# EAGLE design 9Mux_v5 (EAGLE 7.6.0)
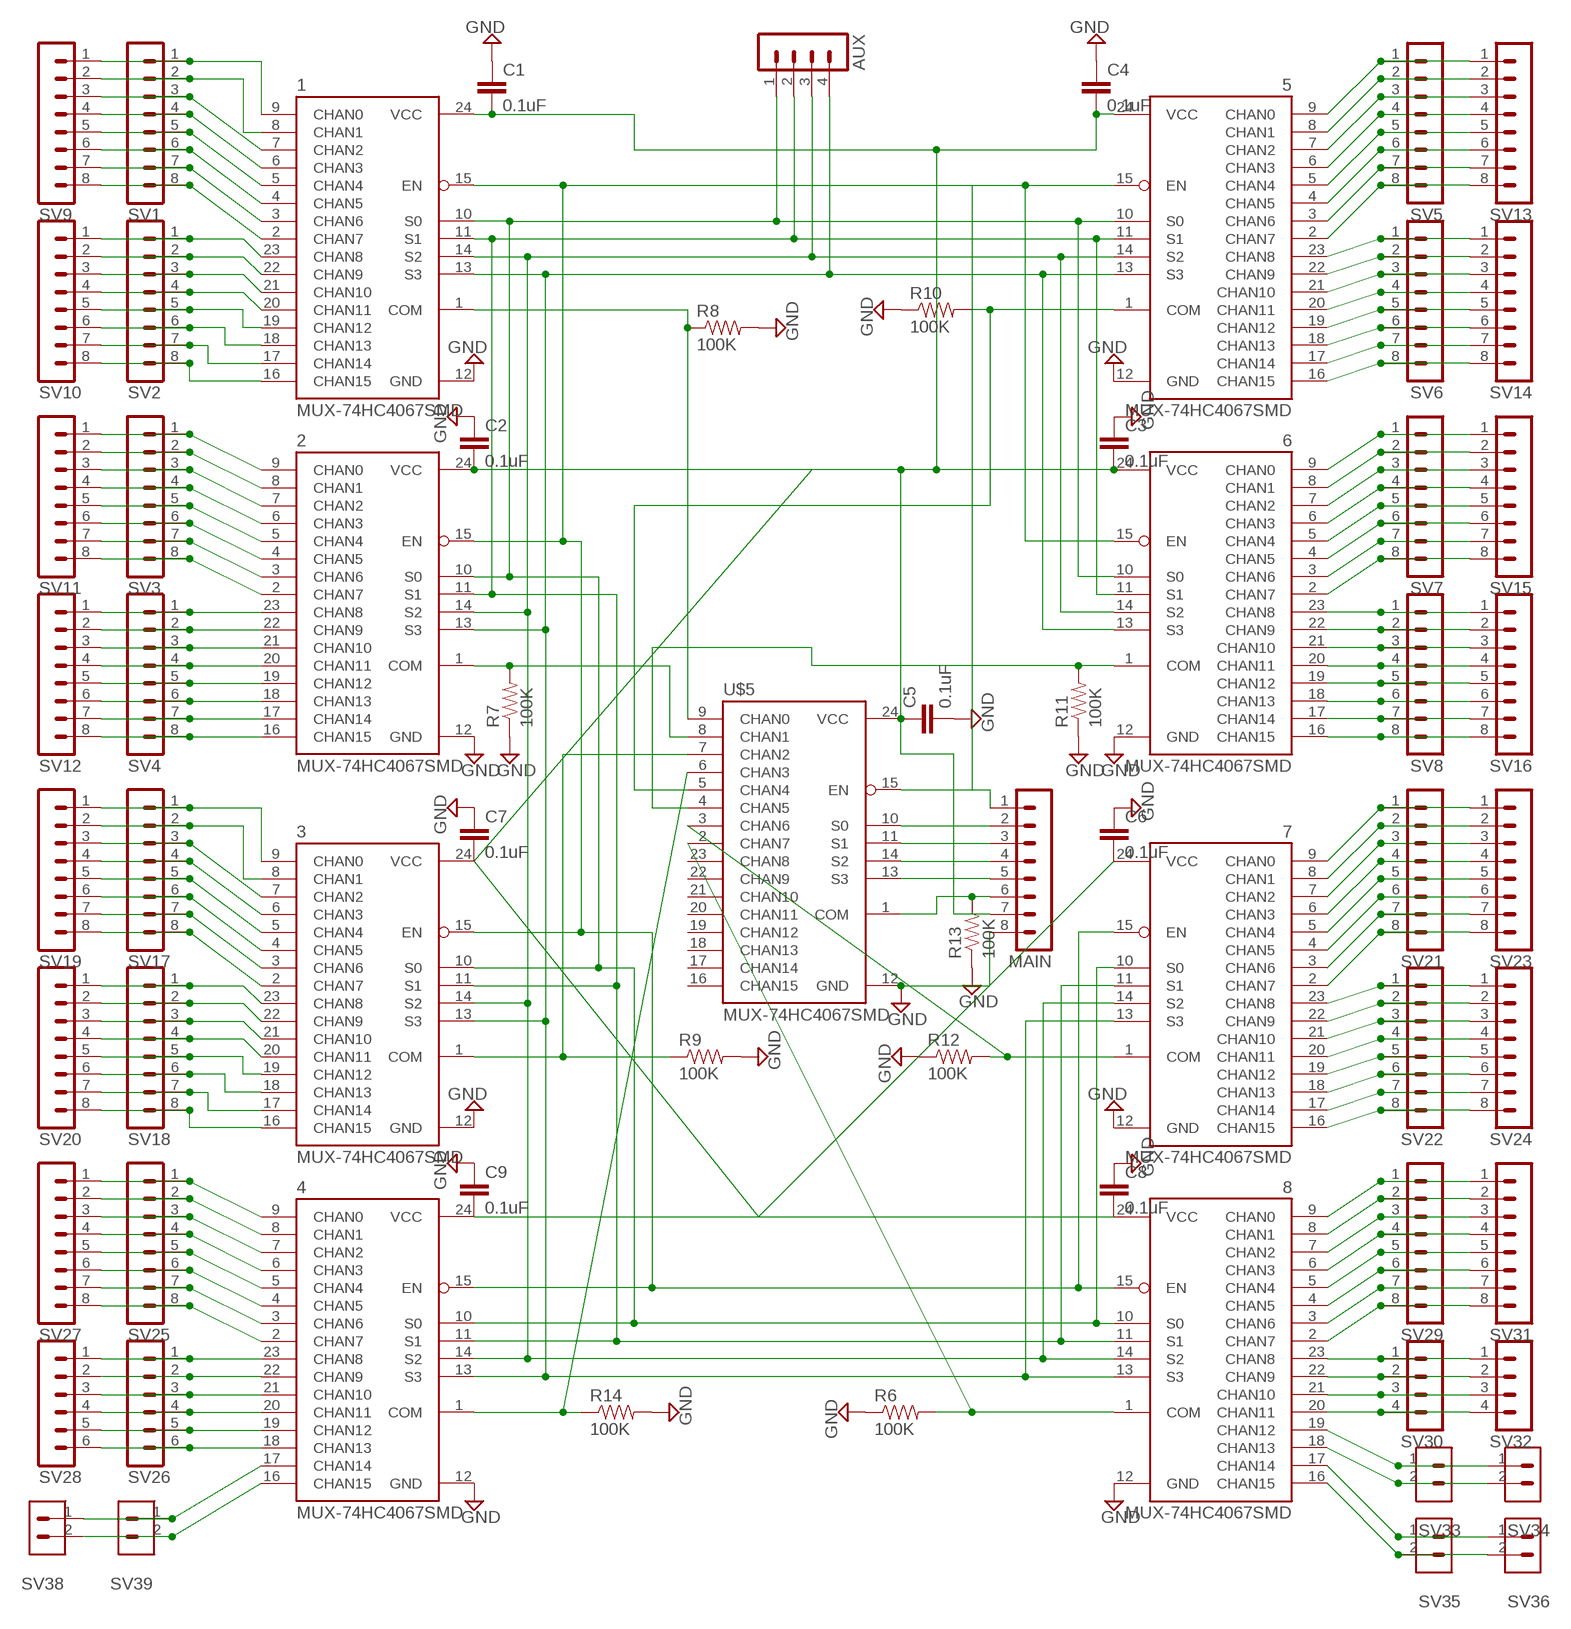
[diagram p0: schematic, sheet 1]

## Parts
1  MUX-74HC4067SMD  [SSOP24]
2  MUX-74HC4067SMD  [SSOP24]
3  MUX-74HC4067SMD  [SSOP24]
4  MUX-74HC4067SMD  [SSOP24]
5  MUX-74HC4067SMD  [SSOP24]
6  MUX-74HC4067SMD  [SSOP24]
7  MUX-74HC4067SMD  [SSOP24]
8  MUX-74HC4067SMD  [SSOP24]
AUX  MA04-1  [MA04-1]
C1  0.1uF  CAP0603-CAP  [0603-CAP]
C2  0.1uF  CAP0603-CAP  [0603-CAP]
C3  0.1uF  CAP0603-CAP  [0603-CAP]
C4  0.1uF  CAP0603-CAP  [0603-CAP]
C5  0.1uF  CAP0603-CAP  [0603-CAP]
C6  0.1uF  CAP0603-CAP  [0603-CAP]
C7  0.1uF  CAP0603-CAP  [0603-CAP]
C8  0.1uF  CAP0603-CAP  [0603-CAP]
C9  0.1uF  CAP0603-CAP  [0603-CAP]
MAIN  MA08-1  [MA08-1]
R6  100K  RESISTOR0603  [0603-RES]
R7  100K  RESISTOR0603  [0603-RES]
R8  100K  RESISTOR0603  [0603-RES]
R9  100K  RESISTOR0603  [0603-RES]
R10  100K  RESISTOR0603  [0603-RES]
R11  100K  RESISTOR0603  [0603-RES]
R12  100K  RESISTOR0603  [0603-RES]
R13  100K  RESISTOR0603  [0603-RES]
R14  100K  RESISTOR0603  [0603-RES]
SV1  MA08-1  [MA08-1]
SV2  MA08-1  [MA08-1]
SV3  MA08-1  [MA08-1]
SV4  MA08-1  [MA08-1]
SV5  MA08-1  [MA08-1]
SV6  MA08-1  [MA08-1]
SV7  MA08-1  [MA08-1]
SV8  MA08-1  [MA08-1]
SV9  MA08-1  [MA08-1]
SV10  MA08-1  [MA08-1]
SV11  MA08-1  [MA08-1]
SV12  MA08-1  [MA08-1]
SV13  MA08-1  [MA08-1]
SV14  MA08-1  [MA08-1]
SV15  MA08-1  [MA08-1]
SV16  MA08-1  [MA08-1]
SV17  MA08-1  [MA08-1]
SV18  MA08-1  [MA08-1]
SV19  MA08-1  [MA08-1]
SV20  MA08-1  [MA08-1]
SV21  MA08-1  [MA08-1]
SV22  MA08-1  [MA08-1]
SV23  MA08-1  [MA08-1]
SV24  MA08-1  [MA08-1]
SV25  MA08-1  [MA08-1]
SV26  MA06-1  [MA06-1]
SV27  MA08-1  [MA08-1]
SV28  MA06-1  [MA06-1]
SV29  MA08-1  [MA08-1]
SV30  MA04-1  [MA04-1]
SV31  MA08-1  [MA08-1]
SV32  MA04-1  [MA04-1]
SV33  MA02-1  [MA03-1]
SV34  MA02-1  [MA03-1]
SV35  MA02-1  [MA03-1]
SV36  MA02-1  [MA03-1]
SV38  MA02-1  [MA03-1]
SV39  MA02-1  [MA03-1]
U$5  MUX-74HC4067SMD  [SSOP24]

## Nets
GND: 1.12(GND) 2.12(GND) 3.12(GND) 4.12(GND) 5.12(GND) 6.12(GND) 7.12(GND) 8.12(GND) C1.1 C2.1 C3.1 C4.1 C5.2 C6.1 C7.1 C8.1 C9.1 MAIN.8 R6.1 R7.1 R8.2 R9.2 R10.1 R11.1 R12.1 R13.1 R14.2 U$5.12(GND)
MAIN: 1.11(S1) 2.11(S1) 3.11(S1) 4.11(S1) 5.11(S1) 6.11(S1) 7.11(S1) 8.11(S1) AUX.2
N$1: 1.9(CHAN0) SV1.1 SV9.1
N$2: 1.8(CHAN1) SV1.2 SV9.2
N$3: 1.16(CHAN15) SV2.8 SV10.8
N$4: 1.17(CHAN14) SV2.7 SV10.7
N$5: 1.18(CHAN13) SV2.6 SV10.6
N$6: 2.8(CHAN1) SV3.2 SV11.2
N$7: 1.19(CHAN12) SV2.5 SV10.5
N$8: 1.20(CHAN11) SV2.4 SV10.4
N$9: 1.21(CHAN10) SV2.3 SV10.3
N$10: 1.22(CHAN9) SV2.2 SV10.2
N$11: 1.23(CHAN8) SV2.1 SV10.1
N$12: 1.7(CHAN2) SV1.3 SV9.3
N$13: 1.6(CHAN3) SV1.4 SV9.4
N$14: 1.5(CHAN4) SV1.5 SV9.5
N$15: 1.4(CHAN5) SV1.6 SV9.6
N$16: 1.3(CHAN6) SV1.7 SV9.7
N$17: 1.2(CHAN7) SV1.8 SV9.8
N$18: 2.9(CHAN0) SV3.1 SV11.1
N$19: 2.7(CHAN2) SV3.3 SV11.3
N$20: 2.6(CHAN3) SV3.4 SV11.4
N$21: 2.5(CHAN4) SV3.5 SV11.5
N$22: 5.5(CHAN4) SV5.5 SV13.5
N$23: 2.4(CHAN5) SV3.6 SV11.6
N$24: 2.3(CHAN6) SV3.7 SV11.7
N$25: 2.2(CHAN7) SV3.8 SV11.8
N$26: 2.23(CHAN8) SV4.1 SV12.1
N$27: 2.22(CHAN9) SV4.2 SV12.2
N$28: 2.21(CHAN10) SV4.3 SV12.3
N$29: 2.20(CHAN11) SV4.4 SV12.4
N$30: 2.19(CHAN12) SV4.5 SV12.5
N$31: 2.18(CHAN13) SV4.6 SV12.6
N$32: 2.17(CHAN14) SV4.7 SV12.7
N$33: 2.16(CHAN15) SV4.8 SV12.8
N$34: 5.9(CHAN0) SV5.1 SV13.1
N$35: 5.8(CHAN1) SV5.2 SV13.2
N$36: 5.7(CHAN2) SV5.3 SV13.3
N$37: 5.6(CHAN3) SV5.4 SV13.4
N$38: 5.4(CHAN5) SV5.6 SV13.6
N$39: 5.3(CHAN6) SV5.7 SV13.7
N$40: 5.2(CHAN7) SV5.8 SV13.8
N$41: 5.23(CHAN8) SV6.1 SV14.1
N$42: 5.22(CHAN9) SV6.2 SV14.2
N$43: 5.21(CHAN10) SV6.3 SV14.3
N$44: 5.20(CHAN11) SV6.4 SV14.4
N$45: 5.19(CHAN12) SV6.5 SV14.5
N$46: 5.18(CHAN13) SV6.6 SV14.6
N$47: 5.17(CHAN14) SV6.7 SV14.7
N$48: 5.16(CHAN15) SV6.8 SV14.8
N$49: 6.9(CHAN0) SV7.1 SV15.1
N$50: 6.8(CHAN1) SV7.2 SV15.2
N$51: 6.7(CHAN2) SV7.3 SV15.3
N$52: 6.6(CHAN3) SV7.4 SV15.4
N$53: 6.5(CHAN4) SV7.5 SV15.5
N$54: 1.10(S0) 2.10(S0) 3.10(S0) 4.10(S0) 5.10(S0) 6.10(S0) 7.10(S0) 8.10(S0) AUX.1
N$55: 6.4(CHAN5) SV7.6 SV15.6
N$56: 1.14(S2) 2.14(S2) 3.14(S2) 4.14(S2) 5.14(S2) 6.14(S2) 7.14(S2) 8.14(S2) AUX.3
N$57: 6.3(CHAN6) SV7.7 SV15.7
N$58: 6.2(CHAN7) SV7.8 SV15.8
N$59: 6.23(CHAN8) SV8.1 SV16.1
N$60: 1.13(S3) 2.13(S3) 3.13(S3) 4.13(S3) 5.13(S3) 6.13(S3) 7.13(S3) 8.13(S3) AUX.4
N$61: 1.15(EN) 2.15(EN) 3.15(EN) 4.15(EN) 5.15(EN) 6.15(EN) 7.15(EN) 8.15(EN) MAIN.1 U$5.15(EN)
N$62: 6.22(CHAN9) SV8.2 SV16.2
N$63: 6.21(CHAN10) SV8.3 SV16.3
N$64: 6.20(CHAN11) SV8.4 SV16.4
N$65: 6.19(CHAN12) SV8.5 SV16.5
N$66: 6.18(CHAN13) SV8.6 SV16.6
N$67: 6.17(CHAN14) SV8.7 SV16.7
N$68: 6.16(CHAN15) SV8.8 SV16.8
N$69: 1.1(COM) R8.1 U$5.9(CHAN0)
N$70: 3.9(CHAN0) SV17.1 SV19.1
N$71: 3.8(CHAN1) SV17.2 SV19.2
N$72: 3.16(CHAN15) SV18.8 SV20.8
N$73: 2.1(COM) R7.2 U$5.8(CHAN1)
N$74: 6.1(COM) R11.2 U$5.4(CHAN5)
N$75: 5.1(COM) R10.2 U$5.5(CHAN4)
N$78: MAIN.2 U$5.10(S0)
N$79: MAIN.3 U$5.11(S1)
N$80: MAIN.4 U$5.14(S2)
N$81: MAIN.5 U$5.13(S3)
N$82: MAIN.6 R13.2 U$5.1(COM)
N$83: 3.17(CHAN14) SV18.7 SV20.7
N$84: 3.18(CHAN13) SV18.6 SV20.6
N$85: 3.19(CHAN12) SV18.5 SV20.5
N$86: 3.20(CHAN11) SV18.4 SV20.4
N$87: 3.21(CHAN10) SV18.3 SV20.3
N$88: 3.22(CHAN9) SV18.2 SV20.2
N$89: 3.23(CHAN8) SV18.1 SV20.1
N$90: 3.7(CHAN2) SV17.3 SV19.3
N$91: 3.6(CHAN3) SV17.4 SV19.4
N$92: 3.5(CHAN4) SV17.5 SV19.5
N$93: 3.4(CHAN5) SV17.6 SV19.6
N$94: 3.3(CHAN6) SV17.7 SV19.7
N$95: 3.2(CHAN7) SV17.8 SV19.8
N$96: 7.9(CHAN0) SV21.1 SV23.1
N$97: 7.8(CHAN1) SV21.2 SV23.2
N$98: 7.7(CHAN2) SV21.3 SV23.3
N$99: 7.6(CHAN3) SV21.4 SV23.4
N$100: 7.5(CHAN4) SV21.5 SV23.5
N$101: 7.4(CHAN5) SV21.6 SV23.6
N$102: 7.3(CHAN6) SV21.7 SV23.7
N$103: 7.2(CHAN7) SV21.8 SV23.8
N$104: 7.23(CHAN8) SV22.1 SV24.1
N$105: 7.22(CHAN9) SV22.2 SV24.2
N$106: 7.21(CHAN10) SV22.3 SV24.3
N$107: 7.20(CHAN11) SV22.4 SV24.4
N$108: 7.19(CHAN12) SV22.5 SV24.5
N$109: 7.18(CHAN13) SV22.6 SV24.6
N$110: 7.17(CHAN14) SV22.7 SV24.7
N$111: 7.16(CHAN15) SV22.8 SV24.8
N$112: 4.9(CHAN0) SV25.1 SV27.1
N$113: 4.8(CHAN1) SV25.2 SV27.2
N$114: 4.7(CHAN2) SV25.3 SV27.3
N$115: 4.6(CHAN3) SV25.4 SV27.4
N$116: 4.5(CHAN4) SV25.5 SV27.5
N$117: 4.4(CHAN5) SV25.6 SV27.6
N$118: 4.3(CHAN6) SV25.7 SV27.7
N$119: 4.2(CHAN7) SV25.8 SV27.8
N$120: 4.23(CHAN8) SV26.1 SV28.1
N$121: 4.22(CHAN9) SV26.2 SV28.2
N$122: 4.21(CHAN10) SV26.3 SV28.3
N$123: 4.20(CHAN11) SV26.4 SV28.4
N$124: 4.19(CHAN12) SV26.5 SV28.5
N$125: 4.18(CHAN13) SV26.6 SV28.6
N$126: 4.17(CHAN14) SV38.1 SV39.1
N$127: 4.16(CHAN15) SV38.2 SV39.2
N$128: 8.9(CHAN0) SV29.1 SV31.1
N$129: 8.8(CHAN1) SV29.2 SV31.2
N$130: 8.7(CHAN2) SV29.3 SV31.3
N$131: 8.6(CHAN3) SV29.4 SV31.4
N$132: 8.5(CHAN4) SV29.5 SV31.5
N$133: 8.4(CHAN5) SV29.6 SV31.6
N$134: 8.3(CHAN6) SV29.7 SV31.7
N$135: 8.2(CHAN7) SV29.8 SV31.8
N$136: 8.23(CHAN8) SV30.1 SV32.1
N$137: 8.22(CHAN9) SV30.2 SV32.2
N$138: 8.21(CHAN10) SV30.3 SV32.3
N$139: 8.20(CHAN11) SV30.4 SV32.4
N$140: 3.1(COM) R9.1 U$5.7(CHAN2)
N$141: 7.1(COM) R12.2 U$5.3(CHAN6)
N$142: 4.1(COM) R14.1 U$5.6(CHAN3)
N$143: 8.1(COM) R6.2 U$5.2(CHAN7)
N$145: 1.24(VCC) 2.24(VCC) 3.24(VCC) 4.24(VCC) 5.24(VCC) 6.24(VCC) 7.24(VCC) 8.24(VCC) C1.2 C2.2 C3.2 C4.2 C5.1 C6.2 C7.2 C8.2 C9.2 MAIN.7 U$5.24(VCC)
N$148: 8.19(CHAN12) SV33.1 SV34.1
N$149: 8.18(CHAN13) SV33.2 SV34.2
N$150: 8.17(CHAN14) SV35.1 SV36.1
N$151: 8.16(CHAN15) SV35.2 SV36.2
Unconnected: U$5.16(CHAN15) U$5.17(CHAN14) U$5.18(CHAN13) U$5.19(CHAN12) U$5.20(CHAN11) U$5.21(CHAN10) U$5.22(CHAN9) U$5.23(CHAN8)

## Library data of the parts
1-8 U$5 = SparkFun-AnalogIC:MUX-74HC4067: 16-channel analog MUX; PROD_ID: IC-08252
AUX SV30 SV32 = con-lstb:MA04-1: PIN HEADER; OC_FARNELL: unknown; OC_NEWARK: unknown
C1-C9 = SparkFun-Passives:CAP: Capacitor Standard 0603 ceramic capacitor, and 0.1" leaded capacitor.
MAIN SV1-SV25 SV27 SV29 SV31 = con-lstb:MA08-1: PIN HEADER; OC_FARNELL: unknown; OC_NEWARK: unknown
R6-R14 = SparkFun-Resistors:RESISTOR: Resistor Basic schematic elements and footprints for 0603, 1206, and PTH resistors.
SV26 SV28 = con-lstb:MA06-1: PIN HEADER; OC_FARNELL: unknown; OC_NEWARK: unknown
SV33-SV36 SV38 SV39 = custom:MA02-1: PIN HEADER; OC_FARNELL: unknown; OC_NEWARK: unknown

## Net classes
0 signal: width 0.254 mm, clearance 0.254 mm

## Board
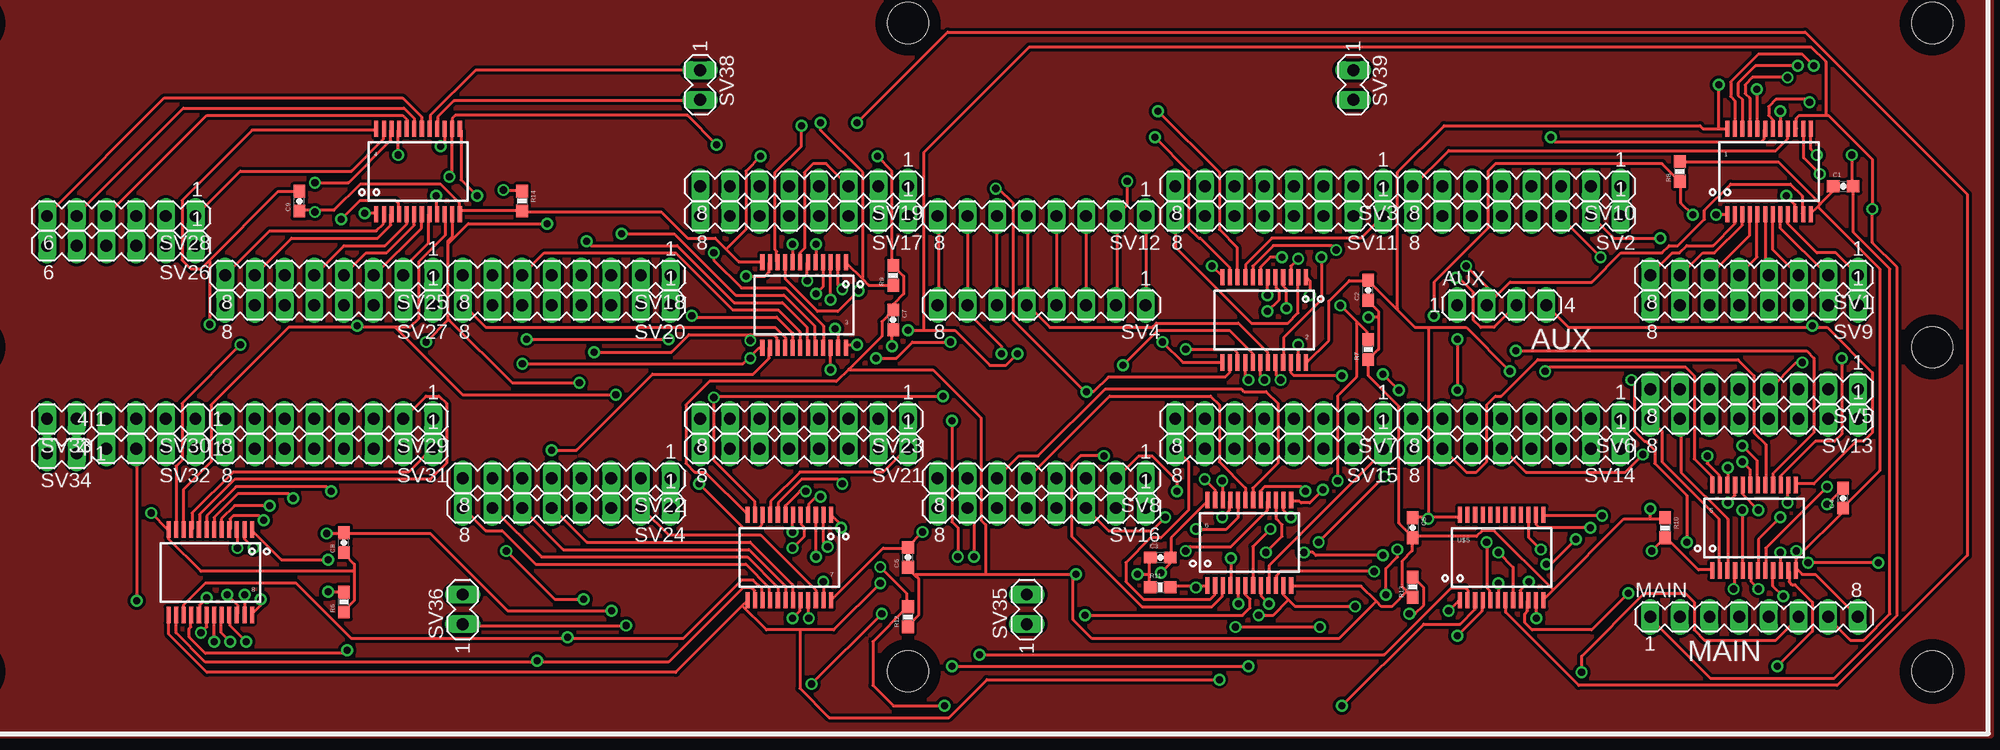
[diagram p1: board, top side]
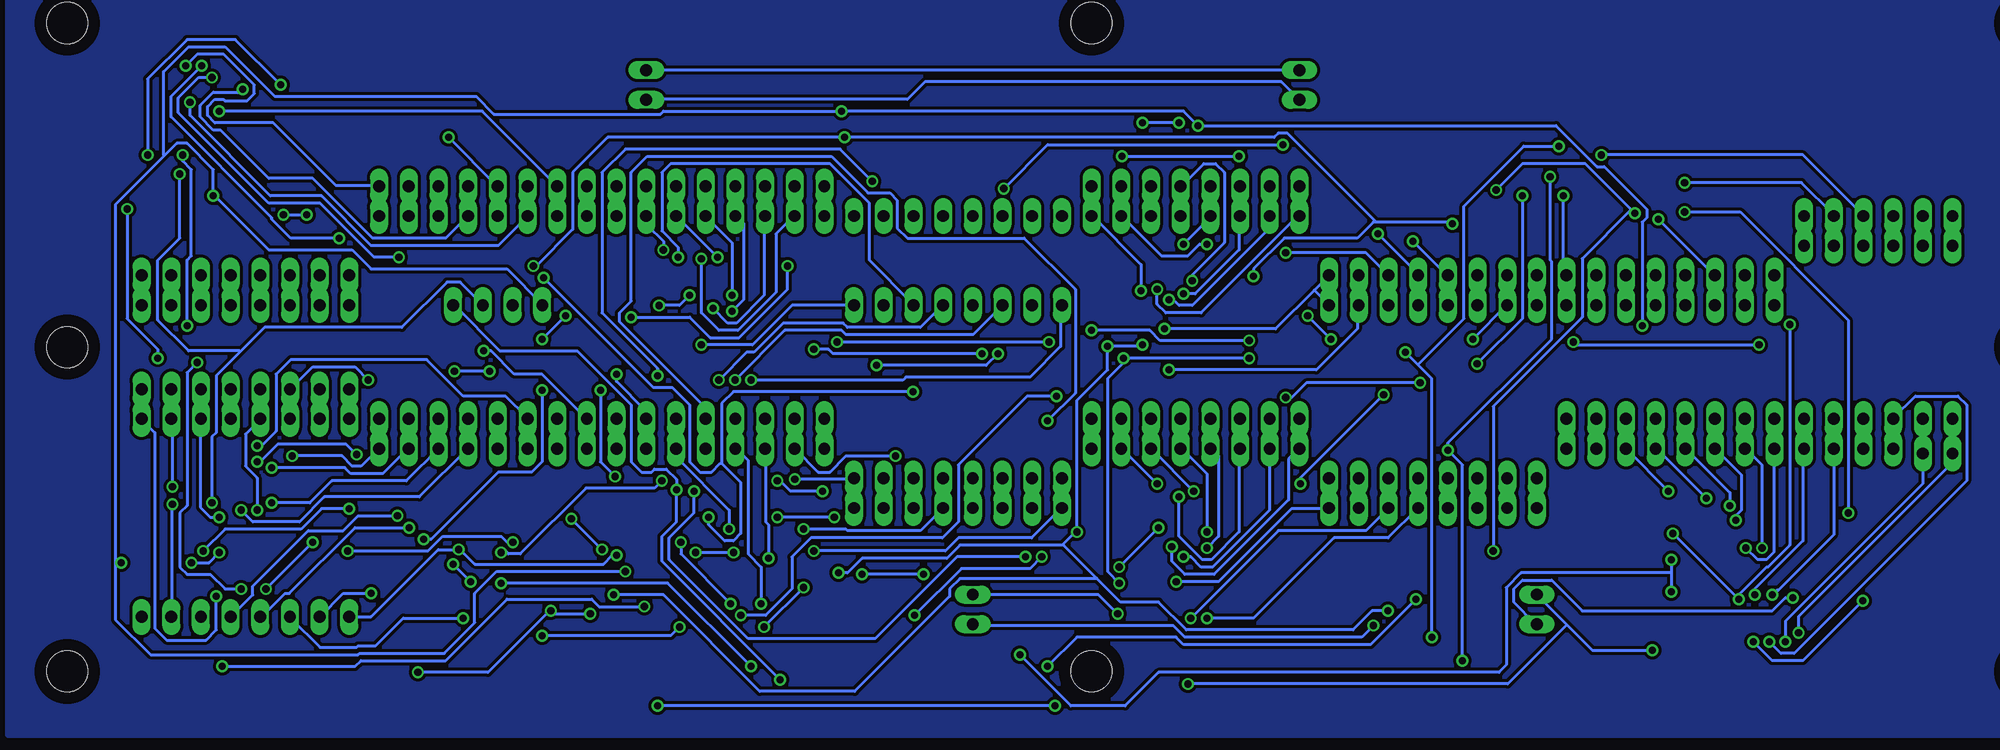
[diagram p2: board, bottom side, seen from below]

No outline drawn. Coordinates in mm, seen from the top.
Copper layers (1*16): Top 0.035mm / dielectric 1.5mm / Bottom 0.035mm
Design rules "default": minimum track width 10mil, minimum drill 24mil, track to track 8mil, track to pad 8mil, pad to pad 8mil, via to via 8mil, smd to smd 8mil, copper to edge 40mil, drill to drill 8mil, minimum pad ring 10mil, minimum via ring 8mil, stop-mask expansion 4mil, vias tented up to drill 0mil, thermal gap 10mil
Holes 3.5 mm at -1.27,70.06 78.74,97.79 166.37,70.06 166.37,42.33 166.37,97.79 -1.27,97.79 -1.27,42.33 78.74,42.33

### Footprints (pad centres in the part's own frame; a part is rotated, then mirrored left to right if it is on the bottom)
SSOP24 = smd 0.348 x 1.397: 1 -3.575,-3.656; 2 -2.925,-3.656; 3 -2.275,-3.656; 4 -1.625,-3.656; 5 -0.975,-3.656; 6 -0.325,-3.656; 7 0.325,-3.656; 8 0.975,-3.656; 9 1.625,-3.656; 10 2.275,-3.656; 11 2.925,-3.656; 12 3.575,-3.656; 13 3.575,3.656; 14 2.925,3.656; 15 2.275,3.656; 16 1.625,3.656; 17 0.975,3.656; 18 0.325,3.656; 19 -0.325,3.656; 20 -0.975,3.656; 21 -1.625,3.656; 22 -2.275,3.656; 23 -2.925,3.656; 24 -3.575,3.656
MA04-1 = drill 1.016 long: 1 -3.81,0; 2 -1.27,0; 3 1.27,0; 4 3.81,0
0603-CAP = smd 1.1 x 1: 1 -0.85,0; 2 0.85,0
MA08-1 = drill 1.016 long: 1 -8.89,0; 2 -6.35,0; 3 -3.81,0; 4 -1.27,0; 5 1.27,0; 6 3.81,0; 7 6.35,0; 8 8.89,0
0603-RES = smd 1.1 x 1: 1 -0.85,0; 2 0.85,0
MA06-1 = drill 1.016 long: 1 -6.35,0; 2 -3.81,0; 3 -1.27,0; 4 1.27,0; 5 3.81,0; 6 6.35,0
MA03-1 = drill 1.016 long: 1 -2.54,0; 2 0,0

### Placement (x,y rotation side)
1  152.4,85.09 0 top
2  109.22,72.39 180 top
3  69.85,73.66 180 top
4  36.83,85.09 0 top
5  151.13,54.61 0 top
6  107.95,53.34 0 top
7  68.58,52.07 180 top
8  19.05,50.8 180 top
AUX  129.54,73.66 0 top
C1  158.75,83.82 0 top
C2  118.11,74.93 90 top
C3  100.33,52.07 0 top
C4  158.75,57.15 90 top
C5  121.92,54.61 270 top
C6  78.74,52.07 90 top
C7  77.47,72.39 270 top
C8  30.48,53.34 90 top
C9  26.67,82.55 90 top
MAIN  151.13,46.99 0 top
R6  30.48,48.26 90 top
R7  118.11,69.85 90 top
R8  144.78,85.09 90 top
R9  77.47,76.2 90 top
R10  143.51,54.61 270 top
R11  100.33,49.53 0 top
R12  78.74,46.99 90 top
R13  121.92,49.53 90 top
R14  45.72,82.55 270 top
SV1  151.13,76.2 180 top
SV2  130.81,81.28 180 top
SV3  110.49,83.82 180 top
SV4  90.17,73.66 180 top
SV5  151.13,66.46 180 top
SV6  130.81,63.92 180 top
SV7  110.49,63.92 180 top
SV8  90.17,58.84 180 top
SV9  151.13,73.66 180 top
SV10  130.81,83.82 180 top
SV11  110.49,81.28 180 top
SV12  90.17,81.28 180 top
SV13  151.13,63.92 180 top
SV14  130.81,61.38 180 top
SV15  110.49,61.38 180 top
SV16  90.17,56.3 180 top
SV17  69.85,81.28 180 top
SV18  49.53,76.2 180 top
SV19  69.85,83.82 180 top
SV20  49.53,73.66 180 top
SV21  69.85,61.38 180 top
SV22  49.53,58.84 180 top
SV23  69.85,63.92 180 top
SV24  49.53,56.3 180 top
SV25  29.21,76.2 180 top
SV26  11.43,78.74 180 top
SV27  29.21,73.66 180 top
SV28  11.43,81.28 180 top
SV29  29.21,63.92 180 top
SV30  13.97,63.92 180 top
SV31  29.21,61.38 180 top
SV32  13.97,61.38 180 top
SV33  5.08,63.92 180 top
SV34  5.08,60.96 180 top
SV35  88.9,48.9 90 top
SV36  40.64,48.9 90 top
SV38  60.96,91.22 270 top
SV39  116.84,91.22 270 top
U$5  129.54,52.07 0 top

### Tracks (layer width: path | path; a pad name or v marks a point on that pad's centre or on a via)
GND  (via drill 0.61)
  Top 0.254: 31.38,50.88 31.38,51.5 30.5,52.38 C8.1 | 31.38,50.88 31.38,48.38 30.5,47.5 R6.1 | 31.38,50.88 18.25,50.88 15.5,53.62 15.5,54.38 8.12 15.38,54.5 v14,55.88 | 28,81.75 29.62,81.75 31.88,84 38.75,84 40.38,82.38 40.38,81.5 4.12 40.5,81.75 45.62,81.75 R14.2 45.75,81.62 57.62,81.62 59.88,79.38 62.25,79.38 63.19,78.44 | 28,81.75 26.75,81.75 C9.1 | 63.19,78.44 64.25,77.38 66.25,77.38 3.12 | v28,81.62 28,81.75 | 99.38,50.62 99.38,52 C3.1 | 99.38,50.62 99.38,49.62 R11.1 | 79.31,50.56 78.75,51.12 C6.1 | 79.31,50.56 79.62,50.25 79.62,47.12 78.75,46.25 R12.1 | v98.38,50.62 99.38,50.62 | 85.38,50.62 79.38,50.62 79.31,50.56 | 85.38,50.62 v93.12,50.62 92.88,50.5 92.88,46.75 94.5,45.12 115.62,45.12 118.81,48.31 | 73.69,68.19 76.5,71 76.5,72.25 77.38,73.12 C7.1 77.5,73.25 77.5,73.75 78.38,74.62 78.38,76.12 77.5,77 R9.2 77.38,77.12 77.38,85.12 v76.12,86.38 | 73.69,68.19 72.62,67.12 61.75,67.12 59.75,65.12 59.75,60.12 60.5,59.38 61.38,59.38 65,55.75 7.12 | 85.38,50.62 85.38,54.88 85,55.25 85,64 80.88,68.12 73.75,68.12 73.69,68.19 | 155.06,52.31 154.75,52 154.75,51 5.12 154.88,51 155.25,50.62 156.38,50.62 160,47 MAIN.8 | 155.06,52.31 158.75,56 C4.1 158.75,56.38 161.88,59.5 161.88,76.75 156.56,82.06 | 156.56,82.06 156,81.5 1.12 | 156.56,82.06 156.81,82.31 | 156.81,82.31 157.88,83.38 157.88,83.75 C1.1 | 156.81,82.31 153.25,85.88 144.88,85.88 R8.2 | 119,72.62 119,73.12 118.12,74 C2.1 | 119,72.62 119,69.88 118.12,69 R7.1 118.12,68.88 118.12,67.62 120.75,65 120.75,55 121.88,53.88 C5.2 | v104.75,77 105.62,76.12 2.12 | 119,72.62 v118.12,72.62 | 121.44,49.19 121,49.62 121,51.75 121.88,52.62 121.88,53.75 C5.2
  Top 0.254: 121.44,49.19 121.88,48.75 R13.1 | 118.81,48.31 119.25,47.88 120.12,47.88 121.44,49.19 | 118.81,48.31 117.5,49.62 111.62,49.62 6.12 | 142.25,55.38 140,55.38 133.94,49.31 | 142.25,55.38 143.5,55.38 R10.1 | 133.94,49.31 133.12,48.5 U$5.12 | 133.94,49.31 128.88,54.38 127.88,54.38 127.38,53.88 122,53.88 C5.2 | v154.75,52.62 155.06,52.31 | 142.25,55.38 v142.25,56.25 | 63.19,78.44 64.88,80.12 64.88,85.12 v66.12,86.38
  Bottom 0.254: v14,55.88 14,72.38 23.25,81.62 v28,81.62 | v93.12,50.62 v98.38,50.62 | v104.75,77 104.75,75 108.88,70.88 111.38,70.88 113.12,72.62 v118.12,72.62 | v154.75,52.62 152.88,54.5 146.38,54.5 144.62,56.25 v142.25,56.25 | v76.12,86.38 v66.12,86.38
MAIN  (via drill 0.61)
  Top 0.254: 6.11 110.88,48.88 111.31,48.44 | 111.31,48.44 111.88,47.88 v117,47.88 | v153.12,42.75 156.12,45.75 156.12,48.25 154.62,49.75 154.38,49.75 154.12,50 154.12,50.88 5.11 | 1.11 155.25,81.5 155.25,83 154.25,84 149.12,84 146.88,81.75 146.88,81 144.62,78.75 143.88,78.75 143.25,78.12 139.75,78.12 137.25,75.62 130.25,75.62 128.38,73.75 AUX.2 129,74.5 v126.5,77 | 8.11 16.12,59.88 16.62,60.38 16.62,65.25 v21.62,70.25 | 39.38,72.38 v37.5,70.5 | 39.38,79 39.38,79.12 39.75,79.5 39.75,81.38 4.11 | 39.38,79 39.38,72.38 | v50.62,67 44.88,67 39.5,72.38 39.38,72.38 | 7.11 65.62,55.75 65.62,56.88 62.12,60.38 v62.12,65.75 62.12,65.88 v81.75,65.88 | v64.88,76.12 66.5,76.12 66.88,76.5 66.88,77.25 3.11 | v47.88,80.62 41.12,80.62 39.5,79 39.38,79 | v99.88,88 102.75,85.12 102.75,80.25 103.62,79.38 103.75,79.38 106.25,76.88 106.25,76.12 2.11 | 111.31,48.44 110,47.12 v108.75,47.12
  Bottom 0.254: v117,47.88 120.88,47.88 121.5,48.5 128.75,48.5 134,43.25 141.25,43.25 141.75,42.75 v153.12,42.75 | v21.62,70.25 37.25,70.25 v37.5,70.5 | v62.12,65.75 61.62,65.75 60.38,67 v50.62,67 | v64.88,76.12 64.88,76.75 62.25,79.38 56,79.38 54.62,80.75 54.5,80.75 | 54.5,80.75 48,80.75 v47.88,80.62 | 54.5,80.75 54.5,80.88 62,88.38 62.75,88.38 63.12,88 v99.88,88 120.12,88 123.12,85 123.12,80.12 126.25,77 v126.5,77 | v108.75,47.12 106.62,47.12 104.38,49.38 104.38,52.12 102.75,53.75 91.5,53.75 90.12,55.12 90.12,60 84.25,65.88 v81.75,65.88
N$1
  Top 0.254: 1.9 154,81.38 154,80.62 156.5,78.12 158.12,78.12 160,76.25 SV1.1 160.12,76.12 160.12,73.75 SV9.1
N$2
  Top 0.254: 1.8 153.38,80.25 157.38,76.25 SV1.2 157.5,76.12 157.5,73.75 SV9.2
N$3
  Top 0.254: 1.16 154,88.62 154,87.88 153,86.88 125,86.88 122,83.88 SV10.8 122,83.75 122,81.38 SV2.8
N$4  (via drill 0.61)
  Top 0.254: v153.38,90.25 1.17 | SV2.7 124.5,81.38 124.5,83.75 SV10.7
  Bottom 0.254: v153.38,90.25 130.88,90.25 124.5,83.88 SV10.7
N$5  (via drill 0.61)
  Top 0.254: v155.88,91 155.62,91.25 153,91.25 152.38,90.62 152.38,89.88 152.75,89.5 152.75,88.75 1.18 | SV2.6 SV10.6
  Bottom 0.254: v155.88,91 155.88,89.88 149,83 144.62,83 140.38,78.75 129.5,78.75 127,81.25 SV2.6
N$6  (via drill 0.61)
  Top 0.254: v115.38,78.38 115,78.75 110,78.75 108.25,77 108.25,76.12 2.8 | SV3.2 116.88,83.75 116.88,81.38 SV11.2
  Bottom 0.254: v115.38,78.38 115.38,79.12 116.75,80.5 116.75,81.25 SV11.2
N$7  (via drill 0.61)
  Top 0.254: v133.75,88 134.12,87.62 151.75,87.62 152,87.88 152,88.62 1.19 | SV2.5 129.62,81.38 129.62,83.75 SV10.5
  Bottom 0.254: v133.75,88 129.62,83.88 SV10.5
N$8  (via drill 0.61)
  Top 0.254: v151.38,92.12 151.38,88.75 1.20 | SV10.4 132.12,83.75 132.12,81.38 SV2.4
  Bottom 0.254: v151.38,92.12 151.62,91.88 153.88,91.88 155,90.75 155,89.75 153.88,88.62 153.25,88.62 149.12,84.5 145.38,84.5 140.25,79.38 134,79.38 132.12,81.25 SV2.4
N$9  (via drill 0.61)
  Top 0.254: v154,93.12 151,93.12 150.38,92.5 150.38,91.75 150.75,91.38 150.75,88.75 1.21 | v138,77.75 134.5,81.25 SV2.3 134.62,81.38 134.62,83.75 SV10.3
  Bottom 0.254: v154,93.12 155.12,93.12 156.88,91.38 156.88,90.12 149.12,82.38 144.75,82.38 140.12,77.75 v138,77.75
N$10  (via drill 0.61)
  Top 0.254: 1.22 150.12,91.25 149.75,91.62 149.75,92.62 151.25,94.12 v154.88,94.12 | v143.12,79.38 139.12,79.38 137.25,81.25 SV2.2 137.25,81.38 137.25,83.75 SV10.2
  Bottom 0.254: v154.88,94.12 157.5,91.5 157.5,89.75 148.88,81.12 148.88,81 147.25,79.38 v143.12,79.38
N$11  (via drill 0.61)
  Top 0.254: v156.25,94.12 155.25,95.12 151.5,95.12 149.12,92.75 149.12,91.5 149.5,91.12 149.5,88.75 1.23 | SV2.1 139.75,81.38 139.75,83.75 SV10.1
  Bottom 0.254: v156.25,94.12 155.25,95.12 153,95.12 150.38,92.5 150.38,91.75 151,91.12 152.88,91.12 153,91.25 153.75,91.25 154.38,90.62 154.38,89.88 153.75,89.25 148.75,89.25 143.38,83.88 139.75,83.88 SV10.1
N$12
  Top 0.254: 1.7 152.75,81.38 152.75,78.38 154.88,76.25 SV1.3 155,76.12 155,73.75 SV9.3
N$13
  Top 0.254: 1.6 152.12,81.38 152.12,76.5 152.38,76.25 SV1.4 152.5,76.12 152.5,73.75 SV9.4
N$14
  Top 0.254: 1.5 151.38,81.38 151.38,77.75 149.88,76.25 SV1.5 149.88,76.12 149.88,73.75 SV9.5
N$15
  Top 0.254: 1.4 150.75,81.38 150.75,79.62 147.38,76.25 SV1.6 147.38,76.12 147.38,73.75 SV9.6
N$16
  Top 0.254: 1.3 150.12,80.5 147.75,78.12 146.75,78.12 144.88,76.25 SV1.7 144.88,76.12 144.88,73.75 SV9.7
N$17
  Top 0.254: 1.2 149.5,81.38 149.5,80.62 147.62,78.75 145.38,78.75 144.75,78.12 144.12,78.12 142.25,76.25 SV1.8 142.25,76.12 142.25,73.75 SV9.8
N$18
  Top 0.254: 2.9 107.62,76.12 107.62,77.12 109.88,79.38 117.5,79.38 119.38,81.25 SV11.1 119.38,81.38 119.38,83.75 SV3.1
N$19  (via drill 0.61)
  Top 0.254: v110.75,77.75 109.75,77.75 108.88,76.88 108.88,76.12 2.7 | SV3.3 114.38,83.75 114.38,81.38 SV11.3
  Bottom 0.254: v110.75,77.75 114.25,81.25 SV11.3
N$20  (via drill 0.61)
  Top 0.254: v109.5,74.5 109.5,76 2.6 | SV3.4 111.75,83.75 111.75,81.38 SV11.4
  Bottom 0.254: v109.5,74.5 109.5,79 111.75,81.25 SV11.4
N$21  (via drill 0.61)
  Top 0.254: v109.5,73.12 110.5,74.12 110.5,74.88 110.25,75.12 110.25,76 2.5 | SV3.5 109.25,83.75 109.25,81.38 SV11.5
  Bottom 0.254: v109.5,73.12 108.5,74.12 108.5,80.62 109.12,81.25 SV11.5
N$22  (via drill 0.61)
  Top 0.254: v150.12,56.12 150.12,51 5.5 | SV5.5 149.88,66.38 149.88,64 SV13.5
  Bottom 0.254: v150.12,56.12 150.12,58.88 151.12,59.88 151.12,62.62 149.88,63.88 SV13.5
N$23  (via drill 0.61)
  Top 0.254: v111.12,73.38 111.12,75 110.88,75.25 110.88,76 2.4 | SV3.6 106.75,83.75 106.75,81.38 SV11.6
  Bottom 0.254: v111.12,73.38 109.88,72.12 109.12,72.12 106.75,74.5 106.75,81.25 SV11.6
N$24  (via drill 0.61)
  Top 0.254: v112.12,77.62 111.5,77 111.5,76.12 2.3 | SV3.7 104.25,83.75 104.25,81.38 SV11.7
  Bottom 0.254: v112.12,77.62 112.12,73 110.62,71.5 109,71.5 105.75,74.75 105.75,79.75 104.25,81.25 SV11.7
N$25
  Top 0.254: 2.2 112.12,76 112.12,73 111.25,72.12 108.12,72.12 101.62,78.62 101.62,81.25 SV11.8 101.62,81.38 101.62,83.75 SV3.8
N$26  (via drill 0.61)
  Top 0.254: v112.12,70.25 112.12,68.75 2.23 | SV12.1 99.12,81.25 99.12,73.75 SV4.1
  Bottom 0.254: v112.12,70.25 107.75,70.25 104.38,73.62 99.12,73.62 SV4.1
N$27  (via drill 0.61)
  Top 0.254: v115.88,67.62 111.75,67.62 111.5,67.88 111.5,68.62 2.22 | v97.5,84.25 97.5,82.25 96.62,81.38 SV12.2 96.62,81.25 96.62,73.75 SV4.2
  Bottom 0.254: v115.88,67.62 115.88,68.25 120.62,73 120.62,85 118.62,87 100.25,87 v97.5,84.25
N$28  (via drill 0.61)
  Top 0.254: v114.12,77.75 114.12,74.12 110.88,70.88 110.88,68.75 2.21 | SV12.3 94,81.25 94,73.75 SV4.3
  Bottom 0.254: v114.12,77.75 114.12,78.62 115.5,80 115.5,85 114.75,85.75 101.12,85.75 97.75,82.38 97.75,77.5 94,73.75 SV4.3
N$29  (via drill 0.61)
  Top 0.254: v110.62,67.25 110.25,67.62 110.25,68.62 2.20 | SV12.4 91.5,81.25 91.5,73.75 SV4.4
  Bottom 0.254: v110.62,67.25 108.25,69.62 107.62,69.62 105.12,72.12 100,72.12 99.62,71.75 93.38,71.75 91.5,73.62 SV4.4
N$30
  Top 0.254: 2.19 109.5,68.75 109.5,69.62 107,72.12 100,72.12 99.62,71.75 90.88,71.75 89,73.62 SV4.5 89,73.75 89,81.25 SV12.5
N$31  (via drill 0.61)
  Top 0.254: v109.25,67.25 108.88,67.62 108.88,68.62 2.18 | SV12.6 86.38,81.25 86.38,73.75 SV4.6
  Bottom 0.254: v109.25,67.25 105,71.5 100.12,71.5 99.75,71.12 88.88,71.12 86.38,73.62 SV4.6
N$32  (via drill 0.61)
  Top 0.254: v97.12,68.5 100.12,71.5 106.25,71.5 108.25,69.5 108.25,68.75 2.17 | v86.75,69.5 86.75,70.12 83.88,73 83.88,73.62 SV4.7 83.88,73.75 83.88,81.25 SV12.7
  Bottom 0.254: v97.12,68.5 87.75,68.5 v86.75,69.5
N$33  (via drill 0.61)
  Top 0.254: v107.88,67.25 107.62,67.5 107.62,68.62 2.16 | SV12.8 81.38,81.25 81.38,73.75 SV4.8
  Bottom 0.254: v107.88,67.25 94.88,67.25 94.62,67.5 84,67.5 81.38,70.12 81.38,73.62 SV4.8
N$34  (via drill 0.61)
  Top 0.254: v153.62,48.75 152.75,49.62 152.75,50.88 5.9 | SV5.1 160.12,66.38 160.12,64 SV13.1
  Bottom 0.254: v153.62,48.75 153.62,45.88 154.5,45 157.88,45 158.88,46 158.88,62.75 160,63.88 SV13.1
N$35  (via drill 0.61)
  Top 0.254: v157.38,58.12 152.12,52.88 152.12,51 5.8 | SV5.2 157.5,66.38 157.5,64 SV13.2
  Bottom 0.254: v157.38,58.12 157.38,63.88 SV13.2
N$36  (via drill 0.61)
  Top 0.254: v153.38,55.5 151.5,53.62 151.5,51 5.7 | SV5.3 155,66.38 155,64 SV13.3
  Bottom 0.254: v153.38,55.5 154.12,55.5 155,56.38 155,63.88 SV13.3
N$37  (via drill 0.61)
  Top 0.254: v151.5,49.38 150.88,50 150.88,50.88 5.6 | v155.25,68.75 154.75,68.75 152.5,66.5 SV5.4 152.5,66.38 152.5,64 SV13.4
  Bottom 0.254: v151.5,49.38 152.88,49.38 154.12,50.62 156.12,50.62 156.75,51.25 156.75,55.88 156.12,56.5 156.12,67.88 v155.25,68.75
N$38  (via drill 0.61)
  Top 0.254: v149.38,49.38 149.5,49.5 149.5,50.88 5.4 | v145.38,53.38 145.38,57.38 142.62,60.12 142.62,61.25 141.88,62 141.75,62 140.88,62.88 140.88,67 v140.62,67.25 | SV13.6 147.38,64 147.38,66.38 SV5.6
  Bottom 0.254: v145.38,53.38 v149.38,49.38 | v140.62,67.25 141.75,68.38 145.38,68.38 147.25,66.5 SV5.6
N$39
  Top 0.254: 5.3 148.88,51 148.88,55.38 144.88,59.38 144.88,63.88 SV13.7 144.88,64 144.88,66.38 SV5.7
N$40
  Top 0.254: 5.2 148.12,51 148.12,55.38 143.25,60.25 143.25,62.88 142.25,63.88 SV13.8 142.25,64 142.25,66.38 SV5.8
N$41  (via drill 0.61)
  Top 0.254: v147.12,60.75 147.12,60.12 148.12,59.12 148.12,58.38 5.23 | SV6.1 139.75,63.88 139.75,61.5 SV14.1
  Bottom 0.254: v147.12,60.75 142.88,60.75 142,59.88 141.25,59.88 139.75,61.38 SV14.1
N$42  (via drill 0.61)
  Top 0.254: v148.88,59.75 148.88,58.38 5.22 | SV6.2 137.25,63.88 137.25,61.5 SV14.2
  Bottom 0.254: v148.88,59.75 142.62,59.75 142.12,59.25 139.38,59.25 137.25,61.38 SV14.2
N$43  (via drill 0.61)
  Top 0.254: v148.88,56.75 149.5,57.38 149.5,58.25 5.21 | SV6.3 134.62,63.88 134.62,61.5 SV14.3
  Bottom 0.254: v148.88,56.75 145.62,56.75 143.75,58.62 137.38,58.62 SV14.3
N$44  (via drill 0.61)
  Top 0.254: v151.5,56.12 150.12,57.5 150.12,58.25 5.20 | SV6.4 132.12,63.88 132.12,61.5 SV14.4
  Bottom 0.254: v151.5,56.12 150.5,55.12 146.5,55.12 144.38,57.25 136.25,57.25 132.12,61.38 SV14.4
N$45  (via drill 0.61)
  Top 0.254: v150.12,60.25 150.75,59.62 150.75,58.38 5.19 | v141.62,60.88 140.12,59.38 131.62,59.38 129.62,61.38 SV14.5 129.62,61.5 129.62,63.88 SV6.5
  Bottom 0.254: v150.12,60.25 149.88,60.25 148.38,61.75 142.5,61.75 v141.62,60.88
N$46  (via drill 0.61)
  Top 0.254: v150.12,61.62 151.38,60.38 151.38,58.38 5.18 | SV6.6 SV14.6
  Bottom 0.254: v150.12,61.62 149.75,61.62 148.5,62.88 148.5,67.75 147.25,69 135.62,69 132.5,65.88 128.88,65.88 127,64 SV6.6
N$47
  Top 0.254: 5.17 152.12,58.38 152.12,61.75 151.12,62.75 151.12,67.62 149.75,69 132.62,69 129.5,65.88 129,65.88 128.25,65.12 128.25,60.25 127.38,59.38 126.5,59.38 124.5,61.38 SV14.7 124.5,61.5 124.5,63.88 SV6.7
N$48  (via drill 0.61)
  Top 0.254: v130.75,69.75 155.62,69.75 156.25,69.12 156.25,62.75 152.75,59.25 152.75,58.38 5.16 | SV14.8 122,61.5 122,63.88 SV6.8
  Bottom 0.254: v130.75,69.75 130.12,69.75 128.12,67.75 125.75,67.75 SV6.8
N$49
  Top 0.254: 6.9 109.62,49.75 109.62,51.38 119.38,61.12 SV15.1 119.38,61.5 119.38,63.88 SV7.1
N$50  (via drill 0.61)
  Top 0.254: v109.62,48.12 109,48.75 109,49.62 6.8 | v119.5,59 v113.88,53.38 | v119.38,67.75 v120.75,66.38 | SV15.2 116.88,61.5 116.88,63.88 SV7.2
  Bottom 0.254: v109.62,48.12 113.88,52.38 v113.88,53.38 | v119.5,59 120.75,60.25 v120.75,66.38 | v119.38,67.75 119.38,67.12 116.88,64.62 116.88,64 SV7.2
N$51  (via drill 0.61)
  Top 0.254: v109.75,54.5 108.25,53 108.25,49.75 6.7 | SV7.3 114.38,63.88 114.38,61.5 SV15.3
  Bottom 0.254: v109.75,54.5 109.75,56.12 114.25,60.62 114.25,61.38 SV15.3
N$52  (via drill 0.61)
  Top 0.254: 6.6 107.62,48.88 108,48.5 108,47.75 107.38,47.12 v93.88,47.12 | v83,52.12 83,54.62 82.5,55.12 v82.5,63.75 | SV15.4 111.75,61.5 111.75,63.88 SV7.4
  Bottom 0.254: v93.88,47.12 89.88,51.12 84,51.12 v83,52.12 | v82.5,63.75 80.12,66.12 80.12,75 84.5,79.38 94.5,79.38 95.38,80.25 95.38,82.62 96,83.25 97.88,83.25 101,86.38 116.75,86.38 118.12,85 118.12,74 119.12,73 119.12,72.25 111.88,65 111.88,64 SV7.4
N$53  (via drill 0.61)
  Top 0.254: v107,48.12 107,49.62 6.5 | SV7.5 109.25,63.88 109.25,61.5 SV15.5
  Bottom 0.254: v107,48.12 107,51.25 108.12,52.38 108.12,60.38 109.12,61.38 SV15.5
N$54  (via drill 0.61)
  Top 0.254: 35,71.75 36.12,71.75 36.88,72.5 36.88,77.38 39.12,79.62 39.12,81.38 4.10 | 35,71.75 31.62,71.75 | 31.62,71.75 25.75,71.75 19.12,65.12 19.12,60.25 16.75,57.88 16.75,54.5 8.10 | v60.88,58.38 64.62,54.62 66,54.62 66.25,54.88 66.25,55.62 7.10 | v53.75,66 40.62,66 35,71.62 35,71.75 | v100.12,90.25 105.38,85 105.38,80.12 106.88,78.62 106.88,76.12 2.10 | v69.62,89 69.62,87.25 67.38,85 67.38,78.38 67.5,78.25 67.5,77.38 3.10 | v118.62,50.88 110.62,50.88 110.25,50.5 110.25,49.75 6.10 | v153.88,83 154.62,82.25 154.62,81.5 1.10 | v153.38,52.5 153.38,51 5.10 | v161.75,51.62 v155.75,51.62 | v31.62,71.88 31.62,71.75
  Bottom 0.254: v60.88,58.38 60.88,58.88 v53.75,66 | v118.62,50.88 129.62,50.88 131.5,49 131.5,46.5 134.12,43.88 141.38,43.88 141.5,43.75 159.25,43.75 162.25,46.75 162.25,51.62 | 162.25,51.62 162.25,82.25 158.06,86.44 | 158.06,86.44 157,87.5 156.12,87.5 153.88,85.25 v153.88,83 153.75,83 149.12,78.38 142,78.38 140.38,76.75 128.75,76.75 125.75,73.75 AUX.1 | v153.38,52.5 154.25,51.62 v155.75,51.62 | 162.25,51.62 v161.75,51.62 | 158.06,86.44 158.12,86.5 158.12,93.62 156,95.75 152.88,95.75 148.62,91.5 131.38,91.5 129.88,90 115.62,90 115.38,90.25 v100.12,90.25 70.88,90.25 v69.62,89 39,89 35.5,85.5 34.88,85.5 31.25,81.88 31.25,81.12 31.62,80.75 v31.62,71.88
N$55  (via drill 0.61)
  Top 0.254: v106.38,52 106.38,49.75 6.4 | SV7.6 106.75,63.88 106.75,61.5 SV15.6
  Bottom 0.254: v106.38,52 106.38,54.88 106.62,55.12 106.62,61.38 SV15.6
N$56  (via drill 0.61)
  Top 0.254: 8.14 16.12,45.62 18.62,43.12 47,43.12 | 47,43.12 58.25,43.12 64.62,49.5 65.38,49.5 65.62,49.25 65.62,48.5 7.14 | v48.25,61.25 50.38,61.25 56.88,67.75 65.5,67.75 66.88,69.12 66.88,70 3.14 | v47,43.25 47,43.12 | v39.5,84.62 39.75,84.88 39.75,88.62 4.14 39.75,89.62 40,89.88 59.88,89.88 v62.38,87.38 | 6.14 110.88,56.12 v111.5,55.5 | 2.14 106.25,68.62 106.25,67.88 105.88,67.5 95.88,67.5 94.62,66.25 v94,66.25 93.88,66.25 87.75,72.38 87.75,82.38 86.5,83.62 v86.25,83.62 | v154,56.75 154,58.25 5.14 | v156.75,84.88 155.38,86.25 155.38,88.62 1.14 | v125.62,76 125.88,76 127.12,74.75 127.12,72.38 127.75,71.75 128.88,71.75 130.75,73.62 AUX.3
  Bottom 0.254: v47,43.25 47,60 v48.25,61.25 48.25,61.88 39.38,70.75 39.38,77.38 39.5,77.5 v39.5,84.62 | v111.5,55.5 111.5,54.88 110.12,53.5 109.38,53.5 108.75,54.12 108.75,58.5 110.38,60.12 | 110.38,60.12 110.38,65.25 109.38,66.25 v94,66.25 | v154,56.75 154,62.38 153.62,62.75 153.62,67.62 151.56,69.69 | 151.56,69.69 149.5,71.75 137.75,71.75 133.88,75.62 132.75,75.62 130.88,73.75 AUX.3 | v156.75,84.88 156.75,79.38 158.62,77.5 158.62,72.38 156,69.75 151.62,69.75 151.56,69.69 | v125.62,76 116.25,66.62 114.62,66.62 113.12,65.12 113.12,60.25 112.25,59.38 111.25,59.38 110.5,60.12 110.38,60.12 | v62.38,87.38 82.5,87.38 v86.25,83.62
N$57  (via drill 0.61)
  Top 0.254: v95.5,60.75 93.5,60.75 92.75,60 92.75,53.88 98.75,47.88 104.75,47.88 105.62,48.75 105.62,49.62 6.3 | SV7.7 104.25,63.88 104.25,61.5 SV15.7
  Bottom 0.254: v95.5,60.75 99.75,60.75 101.12,59.38 102.12,59.38 104.12,61.38 SV15.7
N$58
  Top 0.254: 6.2 105,49.62 105,48.88 104.62,48.5 98.88,48.5 97.38,50 97.38,51.62 99.5,53.75 100.38,53.75 102.75,56.12 102.75,60.25 101.62,61.38 SV15.8 101.62,61.5 101.62,63.88 SV7.8
N$59  (via drill 0.61)
  Top 0.254: v104.12,58.75 105,57.88 105,57 6.23
  Bottom 0.254: v104.12,58.75 99.12,58.75 SV8.1 99.12,58.62 99.12,56.38 SV16.1
N$60  (via drill 0.61)
  Top 0.254: v114.25,57.88 113.12,56.75 112.38,56.75 112.25,56.88 111.62,56.88 6.13 | 156.12,71.75 135.25,71.75 133.38,73.62 AUX.4 | 156.12,71.75 157.38,71.75 161.25,67.88 161.25,62.75 160.5,62 159.88,62 156.25,58.38 154.75,58.38 5.13 | v156.5,86.5 156,87 156,88.62 1.13 | v156.12,71.88 156.12,71.75 | 64.56,47.94 65,48.38 7.13 | 64.56,47.94 58.88,42.25 18.75,42.25 15.5,45.5 15.5,47.12 8.13 | 65.19,69.19 64.62,68.62 v45.75,68.62 | 65.19,69.19 66,70 66.25,70 3.13 | v41.88,83 40.5,84.38 40.5,88.62 4.13 | v100.5,70.5 102.25,68.75 105.62,68.75 2.13 | v82.38,70.5 79.12,70.5 77.75,69.12 v76,69.12 | v65.25,69.12 65.19,69.19 | 64.56,47.94 66.62,45.88 69.5,45.88 | 69.5,45.88 72.38,45.88 v76.38,49.88 | v105.38,41.62 85.5,41.62 82.25,38.38 72,38.38 69.5,40.88 69.5,45.88
  Bottom 0.254: AUX.4 133.25,73.62 129.38,69.75 122.75,69.75 118.12,65.12 118.12,60.25 117.25,59.38 116.38,59.38 116.12,59.62 115.12,59.62 114.25,58.75 v114.25,57.88 114.25,55.12 115.5,53.88 115.5,51.75 v105.38,41.62 | v156.5,86.5 156.5,86 155.75,85.25 155.75,77.88 156.12,77.5 v156.12,71.88 | v45.75,68.62 41.88,72.5 v41.88,83 | v82.38,70.5 v100.5,70.5 | v65.25,69.12 v76,69.12 75.75,69 77.38,67.38 77.38,50.88 v76.38,49.88
N$61  (via drill 0.61)
  Top 0.254: v158.62,69.12 158.62,62.62 158,62 156.38,62 153.38,59 153.38,58.38 5.15 | 157.25,89.88 155,89.88 154.75,89.62 154.75,88.75 1.15 | 157.25,89.88 157.5,89.88 161.25,86.12 v161.25,81.88 161.25,79 163.38,76.88 163.38,47.12 158,41.75 147.38,41.75 142.25,46.88 MAIN.1 | v132.88,52.75 131.88,53.75 131.88,55.62 U$5.15 | v109.38,52.5 110.75,53.88 110.75,54.88 110.25,55.38 110.25,56.88 6.15 | v112.62,52.5 113.38,52.5 113.62,52.25 v119.38,52.25 | 49.62,45.12 59.5,45.12 64.5,50.12 65.5,50.12 66.25,49.38 66.25,48.5 7.15 | 49.62,45.12 31.12,45.12 26.38,49.88 18.62,49.88 16.75,48 16.75,47.25 8.15 | 65.25,71.12 60,71.12 58.5,69.62 v51.88,69.62 | 65.25,71.12 67.25,71.12 67.5,70.88 67.5,70.12 3.15 | v49.62,45.25 49.62,45.12 | v38.75,87.25 39.12,87.62 39.12,88.62 4.15 | v102.5,69.88 106.62,69.88 106.88,69.62 106.88,68.75 2.15 | v88.12,69.5 87.12,68.5 85.75,68.5 82.75,71.5 80.12,71.5 | v78.75,71.5 80.12,71.5 | 65.25,71.12 v65.25,70.62 | 157.25,89.88 157.25,94.5 156,95.75 89.12,95.75 80.12,86.75 80.12,71.5
  Bottom 0.254: v158.62,69.12 158.62,69.88 161.25,72.5 v161.25,81.88 | MAIN.1 142.12,47 140.38,47 134.62,52.75 v132.88,52.75 132.75,52.75 131.5,51.5 120.5,51.5 119.75,52.25 v119.38,52.25 | v112.62,52.5 v109.38,52.5 | 50.81,68.56 49.62,67.38 v49.62,45.25 | 50.81,68.56 v51.88,69.62 | v38.75,87.25 41.75,87.25 46.88,82.12 46.88,72.5 50.81,68.56 | v102.5,69.88 101.25,69.88 100.88,69.5 v88.12,69.5 | v78.75,71.5 73.75,71.5 72.88,70.62 v65.25,70.62
N$62  (via drill 0.61)
  Top 0.254: v105.62,58.62 105.62,57 6.22 | v101.75,57.75 101.75,58.62 99.62,60.75 98.5,60.75 96.62,58.88 SV8.2 96.62,58.75 96.62,56.38 SV16.2
  Bottom 0.254: v105.62,58.62 105.38,58.62 104.5,57.75 v101.75,57.75
N$63  (via drill 0.61)
  Top 0.254: v105.62,55.5 106.25,56.12 106.25,56.88 6.21 | v100.75,55.5 99.62,54.38 95.88,54.38 94,56.25 SV16.3 94,56.38 94,58.75 SV8.3
  Bottom 0.254: v100.75,55.5 v105.62,55.5
N$64  (via drill 0.61)
  Top 0.254: v103.38,54.5 106,54.5 107,55.5 107,56.88 6.20 | SV8.4 91.5,58.75 91.5,56.38 SV16.4
  Bottom 0.254: v103.38,54.5 99.75,54.5 99.62,54.38 93.38,54.38 91.5,56.25 SV16.4
N$65
  Top 0.254: 6.19 107.62,58 105.38,60.25 105.38,65.12 104.62,65.88 96,65.88 89,58.88 SV8.5 89,58.75 89,56.38 SV16.5
N$66
  Top 0.254: 6.18 108.25,57 108.25,58 110.38,60.12 110.38,65.25 109.38,66.25 107.5,66.25 107.25,66.5 95.62,66.5 89.88,60.75 88.25,60.75 86.38,58.88 SV8.6 86.38,58.75 86.38,56.38 SV16.6
N$67  (via drill 0.61)
  Top 0.254: v112.75,57.75 112.38,58.12 109.25,58.12 108.88,57.75 108.88,57 6.17 | v84.38,52.12 84.38,55.75 83.88,56.25 SV16.7 83.88,56.38 83.88,58.75 SV8.7
  Bottom 0.254: v112.75,57.75 112.75,55.88 114.88,53.75 114.88,51.88 108.12,45.12 97.25,45.12 90.25,52.12 v84.38,52.12
N$68  (via drill 0.61)
  Top 0.254: v102.5,52.62 102.88,53 106.38,53 109.5,56.12 109.5,56.88 6.16 | SV8.8 81.38,58.75 81.38,56.38 SV16.8
  Bottom 0.254: v102.5,52.62 91.25,52.62 90.12,53.75 83.88,53.75 81.38,56.25 SV16.8
N$69  (via drill 0.61)
  Top 0.254: v145.88,81.38 144.88,82.38 144.88,84.12 R8.1 144.75,84.25 143.25,85.75 129,85.75 128.38,85.12 128.38,80.25 123.75,75.62 v123.75,72.75 | v147.88,81.38 148.75,81.38 1.1 | v131.88,50 131.12,49.25 131.12,48.5 U$5.9 | v133.38,51.5 133.75,51.5 v135.88,53.62 | v125.75,70.75 v125.75,66.38
  Bottom 0.254: v147.88,81.38 v145.88,81.38 | v133.38,51.5 v131.88,50 | v135.88,53.62 135.25,53.62 129.5,59.38 126.62,59.38 125.75,60.25 v125.75,66.38 | v123.75,72.75 v125.75,70.75
N$70  (via drill 0.61)
  Top 0.254: v74.5,74.88 72.75,73.12 71,73.12 68.25,75.88 68.25,77.25 3.9 | SV19.1 78.75,83.75 78.75,81.38 SV17.1
  Bottom 0.254: v74.5,74.88 74.5,77.12 78.62,81.25 SV17.1
N$71  (via drill 0.61)
  Top 0.254: v68.88,78.88 3.8 | SV19.2 76.25,83.75 76.25,81.38 SV17.2
  Bottom 0.254: v68.88,78.88 69.5,78.88 70.5,77.88 72.75,77.88 76.12,81.25 SV17.2
N$72
  Top 0.254: 3.16 68.25,70.12 68.25,70.88 67.38,71.75 42.62,71.75 40.75,73.62 SV20.8 40.75,73.75 40.75,76.12 SV18.8
N$73  (via drill 0.61)
  Top 0.254: v115.75,73.62 117.19,72.19 | 117.19,72.19 118,71.38 118,70.75 R7.2 | v113.12,74.5 113.12,75.75 112.88,76 2.1 | v129.25,52.5 130.5,51.25 130.5,48.5 U$5.8 | v115.5,58.62 115.5,65.88 117.12,67.5 117.12,72.12 117.19,72.19
  Bottom 0.254: v115.75,73.62 114,73.62 v113.12,74.5 | v129.25,52.5 128.75,52.5 128.62,52.38 127.62,52.38 122,58 116.12,58 v115.5,58.62
N$74  (via drill 0.61)
  Top 0.254: 103.38,49.62 104.38,49.62 6.1 | 103.38,49.62 101.25,49.62 R11.2 | v125.75,45.38 127.88,47.5 127.88,48.38 U$5.4 | v106.75,46.12 v114,46.12 | v103.38,49.5 103.38,49.62
  Bottom 0.254: v125.75,45.38 114.75,45.38 v114,46.12 | v103.38,49.5 v106.75,46.12
N$75  (via drill 0.61)
  Top 0.254: 5.1 147.5,51 146.38,51 143.62,53.75 R10.2 v142.38,52.62 | v128.25,53.38 128.25,49.5 128.5,49.25 128.5,48.5 U$5.5
  Bottom 0.254: v128.25,53.38 128.75,53.38 129.25,53.88 134.25,53.88 135.5,52.62 v142.38,52.62
N$76
  pour Top: -5.08,102.87 -5.08,36.83 171.45,36.83 171.45,102.87
N$77
  pour Bottom: -5.08,102.87 -5.08,36.83 171.45,36.83 171.45,102.87
N$78  (via drill 0.61)
  Top 0.254: v140.38,49 137.25,45.88 132.12,45.88 131.5,46.5 131.5,47.25 131.75,47.5 131.75,48.38 U$5.10
  Bottom 0.254: v140.38,49 142.75,49 144.75,47 MAIN.2
N$79  (via drill 0.61)
  Top 0.254: v132.5,46.88 132.5,48.38 U$5.11
  Bottom 0.254: v132.5,46.88 137.62,46.88 140,44.5 141.5,44.5 141.62,44.38 144.75,44.38 147.25,46.88 MAIN.3
N$80  (via drill 0.61)
  Top 0.254: v137.12,54.62 132.75,54.62 132.5,54.88 132.5,55.62 U$5.14
  Bottom 0.254: v137.12,54.62 141.75,54.62 147.38,49 147.75,49 149.75,47 MAIN.4
N$81  (via drill 0.61)
  Top 0.254: v138.12,55.62 133.12,55.62 U$5.13
  Bottom 0.254: v138.12,55.62 141.5,55.62 142.75,54.38 145.75,54.38 150.5,49.62 150.5,48.88 152.38,47 MAIN.5
N$82  (via drill 0.61)
  Top 0.254: v121.62,47.25 122.12,47.25 122.88,48 122.88,49.5 122,50.38 R13.2 | v125,47.5 125.88,48.38 U$5.1 | v136.38,42.25 136.38,43.62 141.75,49 145.25,49 146,48.25 146,45.88 146.88,45 153,45 154.88,46.88 MAIN.6
  Bottom 0.254: v121.62,47.25 124.75,47.25 v125,47.5 125.12,47.5 130.38,42.25 v136.38,42.25
N$83  (via drill 0.61)
  Top 0.254: 3.17 68.88,71.25 67.5,72.62 60.38,72.62 v60.25,72.75 | v46.12,70.75 v58.25,70.75 | SV18.7 43.25,76.12 43.25,73.75 SV20.7
  Bottom 0.254: v58.25,70.75 v60.25,72.75 | v46.12,70.75 43.25,73.62 SV20.7
N$84
  Top 0.254: 3.18 69.5,70.12 69.5,71.38 67.62,73.25 63.75,73.25 58.88,78.12 47.62,78.12 45.75,76.25 SV18.6 45.75,76.12 45.75,73.75 SV20.6
N$85  (via drill 0.61)
  Top 0.254: v51.25,79.12 51.62,78.75 59,78.75 63.88,73.88 68,73.88 70.12,71.75 70.12,70.12 3.19 | SV20.5 48.25,73.75 48.25,76.12 SV18.5
  Bottom 0.254: v51.25,79.12 48.38,76.25 SV18.5
N$86  (via drill 0.61)
  Top 0.254: v54.25,79.75 58.75,79.75 64,74.5 68.12,74.5 70.75,71.88 70.75,70.12 3.20 | SV20.4 50.88,73.75 50.88,76.12 SV18.4
  Bottom 0.254: v54.25,79.75 50.75,76.25 SV18.4
N$87  (via drill 0.61)
  Top 0.254: v62.12,78.12 62.12,77.5 64.5,75.12 68.25,75.12 71.5,71.88 71.5,70.12 3.21 | SV20.3 53.38,73.75 53.38,76.12 SV18.3
  Bottom 0.254: v62.12,78.12 55.25,78.12 53.38,76.25 SV18.3
N$88  (via drill 0.61)
  Top 0.254: v72.12,68.12 3.22 | SV18.2 55.88,76.12 55.88,73.75 SV20.2
  Bottom 0.254: v72.12,68.12 59.5,68.12 56,71.62 56,73.62 SV20.2
N$89  (via drill 0.61)
  Top 0.254: v72.5,71.62 72.75,71.38 72.75,70.12 3.23
  Bottom 0.254: v72.5,71.62 63,71.62 59.69,74.94 | 59.69,74.94 58.5,76.12 SV18.1 | 59.69,74.94 58.5,73.75 SV20.1
N$90
  Top 0.254: 3.7 69.5,77.38 69.5,78.12 69.88,78.5 69.88,85 70.62,85.75 71.75,85.75 73.62,83.88 SV19.3 73.75,83.75 73.75,81.38 SV17.3
N$91  (via drill 0.61)
  Top 0.254: v70.12,75.75 70.12,77.25 3.6 | SV17.4 71.12,81.38 71.12,83.75 SV19.4
  Bottom 0.254: v70.12,75.75 70.12,76.25 67.38,79 67.38,85 68.12,85.75 69.12,85.75 71,83.88 SV19.4
N$92  (via drill 0.61)
  Top 0.254: v70.88,78.88 70.88,77.38 3.5 | SV19.5 68.62,83.75 68.62,81.38 SV17.5
  Bottom 0.254: v70.88,78.88 68.5,81.25 SV17.5
N$93  (via drill 0.61)
  Top 0.254: v70.88,74.62 71.5,75.25 71.5,77.25 3.4 | SV19.6 66.12,83.75 66.12,81.38 SV17.6
  Bottom 0.254: v70.88,74.62 69.88,74.62 66.12,78.38 66.12,81.25 SV17.6
N$94  (via drill 0.61)
  Top 0.254: v72.12,74.12 3.3 | SV17.7 SV19.7
  Bottom 0.254: v72.12,74.12 71.75,74.12 71.25,73.62 70.12,73.62 63.5,80.25 SV17.7
N$95  (via drill 0.61)
  Top 0.254: v73.12,75 72.75,75.38 72.75,77.25 3.2
  Bottom 0.254: v73.12,75 73.12,73.75 72.38,73 69.38,73 61,81.38 SV17.8 61,81.5 61,83.75 SV19.8
N$96
  Top 0.254: 7.9 67,55.75 67,56.88 69.5,59.38 76.62,59.38 78.62,61.38 SV21.1 78.75,61.5 78.75,63.88 SV23.1
N$97  (via drill 0.61)
  Top 0.254: v73.12,58.38 72.75,58.75 69.62,58.75 67.62,56.75 67.62,55.75 7.8 | SV23.2 76.25,63.88 76.25,61.5 SV21.2
  Bottom 0.254: v73.12,58.38 76.12,61.38 SV21.2
N$98  (via drill 0.61)
  Top 0.254: v70,57.75 69.5,57.75 68.25,56.5 68.25,55.75 7.7 | SV23.3 73.75,63.88 73.75,61.5 SV21.3
  Bottom 0.254: v70,57.75 73.62,61.38 SV21.3
N$99  (via drill 0.61)
  Top 0.254: v68.88,54.25 68.88,55.62 7.6 | SV23.4 71.12,63.88 71.12,61.5 SV21.4
  Bottom 0.254: v68.88,54.25 68.88,59.25 71,61.38 SV21.4
N$100  (via drill 0.61)
  Top 0.254: v68.88,52.88 69.88,53.88 69.88,54.62 69.62,54.88 69.62,55.62 7.5 | SV23.5 68.62,63.88 68.62,61.5 SV21.5
  Bottom 0.254: v68.88,52.88 67.88,53.88 67.88,60.75 68.5,61.38 SV21.5
N$101  (via drill 0.61)
  Top 0.254: v71.25,57.25 70.88,57.25 70.25,56.62 70.25,55.75 7.4 | SV23.6 66.12,63.88 66.12,61.5 SV21.6
  Bottom 0.254: v71.25,57.25 71.25,53.88 69.25,51.88 68.5,51.88 66.12,54.25 66.12,61.38 SV21.6
N$102  (via drill 0.61)
  Top 0.254: v70.88,52.12 70.88,55.62 7.3 | SV21.7 SV23.7
  Bottom 0.254: v70.88,52.12 70.25,52.12 69.38,51.25 68.38,51.25 63.5,56.12 SV21.7
N$103  (via drill 0.61)
  Top 0.254: v71.88,53 71.5,53.38 71.5,55.62 7.2 | SV23.8 61,63.88 61,61.5 SV21.8
  Bottom 0.254: v71.88,53 71.88,51.75 70.75,50.62 68.25,50.62 61.88,57 61.88,60.5 61,61.38 SV21.8
N$104  (via drill 0.61)
  Top 0.254: v71.5,50 71.5,48.5 7.23 | SV22.1 58.5,58.75 58.5,56.38 SV24.1
  Bottom 0.254: v71.5,50 67.88,50 61.62,56.25 58.5,56.25 SV24.1
N$105
  Top 0.254: 7.22 70.88,48.5 70.88,49.25 66.12,54 58.25,54 56,56.25 SV24.2 55.88,56.38 55.88,58.75 SV22.2
N$106  (via drill 0.61)
  Top 0.254: v70.25,46.88 70.25,48.38 7.21 | SV22.3 53.38,58.75 53.38,56.38 SV24.3
  Bottom 0.254: v70.25,46.88 62.75,54.38 55.25,54.38 53.38,56.25 SV24.3
N$107  (via drill 0.61)
  Top 0.254: v68.88,46.88 69.5,47.5 69.5,48.38 7.20 | SV22.4 50.88,58.75 50.88,56.38 SV24.4
  Bottom 0.254: v68.88,46.88 64.88,46.88 58,53.75 53.38,53.75 50.88,56.25 SV24.4
N$108
  Top 0.254: 7.19 68.88,48.5 68.88,49.75 65.25,53.38 51.25,53.38 48.38,56.25 SV24.5 48.25,56.38 48.25,58.75 SV22.5
N$109
  Top 0.254: 7.18 68.25,48.5 68.25,49.62 65.12,52.75 49.25,52.75 45.75,56.25 SV24.6 45.75,56.38 45.75,58.75 SV22.6
N$110
  Top 0.254: 7.17 67.62,48.5 67.62,49.5 65,52.12 47.38,52.12 43.25,56.25 SV24.7 43.25,56.38 43.25,58.75 SV22.7
N$111
  Top 0.254: 7.16 66.88,48.5 66.88,49.5 64.88,51.5 46.88,51.5 44,54.38 42.62,54.38 40.75,56.25 SV24.8 40.75,56.38 40.75,58.75 SV22.8
N$112  (via drill 0.61)
  Top 0.254: v38.38,83 38.38,81.5 4.9 | SV27.1 38.12,73.75 38.12,76.12 SV25.1
  Bottom 0.254: v38.38,83 38.38,76.5 38.12,76.25 SV25.1
N$113
  Top 0.254: 4.8 37.75,81.38 37.75,79 35.62,76.88 35.62,76.25 SV25.2 35.62,76.12 35.62,73.75 SV27.2
N$114
  Top 0.254: 4.7 37.12,81.38 37.12,80.25 33.12,76.25 SV25.3 33.12,76.12 33.12,73.75 SV27.3
N$115
  Top 0.254: 4.6 36.5,81.38 36.5,80.5 34.12,78.12 32.38,78.12 30.5,76.25 SV25.4 30.5,76.12 30.5,73.75 SV27.4
N$116
  Top 0.254: 4.5 35.88,81.38 35.88,80.62 34,78.75 30.5,78.75 28,76.25 SV25.5 28,76.12 28,73.75 SV27.5
N$117  (via drill 0.61)
  Top 0.254: v30.25,81 31.88,82.62 34.88,82.62 35.12,82.38 35.12,81.5 4.4 | SV27.6 25.5,73.75 25.5,76.12 SV25.6
  Bottom 0.254: v30.25,81 25.5,76.25 SV25.6
N$118
  Top 0.254: 4.3 34.5,81.38 34.5,80.5 33.38,79.38 26,79.38 22.88,76.25 SV25.7 22.88,76.12 22.88,73.75 SV27.7
N$119
  Top 0.254: 4.2 33.88,81.38 33.88,80.62 33.25,80 24.12,80 20.38,76.25 SV25.8 20.38,76.12 20.38,73.75 SV27.8
N$120
  Top 0.254: 4.23 33.88,88.62 33.88,87.88 31.12,85.12 21.62,85.12 SV28.1 17.88,81.25 17.88,78.75 SV26.1
N$121  (via drill 0.61)
  Top 0.254: v28,84.12 30.88,84.12 34.5,87.75 34.5,88.62 4.22 | SV26.2 15.25,81.25 SV28.2
  Bottom 0.254: v28,84.12 18,84.12 15.25,81.38 SV28.2
N$122  (via drill 0.61)
  Top 0.254: v35.12,86.5 35.12,88.62 4.21 | SV26.3 12.75,78.75 12.75,81.25 SV28.3
  Bottom 0.254: v35.12,86.5 17.88,86.5 12.75,81.38 SV28.3
N$123
  Top 0.254: 4.20 35.88,88.75 35.88,89.5 35.5,89.88 18.75,89.88 10.25,81.38 SV28.4 10.25,81.25 10.25,78.75 SV26.4
N$124
  Top 0.254: 4.19 36.5,89.62 35.62,90.5 16.75,90.5 7.62,81.38 SV28.5 7.62,81.25 SV26.5
N$125
  Top 0.254: 4.18 37.12,88.75 37.12,89.75 35.5,91.38 15.12,91.38 5.12,81.38 SV28.6 5.12,81.25 5.12,78.75 SV26.6
N$126
  Top 0.254: 4.17 37.88,88.75 37.88,89.88 41.75,93.75 60.88,93.75 SV38.1
  Bottom 0.254: SV39.1 116.75,93.75 61,93.75 SV38.1
N$127
  Top 0.254: 4.16 38.5,88.75 38.5,89.75 39.88,91.12 60.88,91.12 SV38.2
  Bottom 0.254: SV39.2 116.75,91.25 94.5,91.25 93,92.75 62.5,92.75 61,91.25 SV38.2
N$128
  Top 0.254: 8.9 17.5,54.5 17.5,55.88 21,59.38 36,59.38 38,61.38 SV31.1 38.12,61.5 38.12,63.88 SV29.1
N$129
  Top 0.254: 8.8 18.12,54.5 18.12,55.75 21.12,58.75 37.88,58.75 39.25,60.12 39.25,65.25 38.62,65.88 37.5,65.88 35.62,64 SV29.2 35.62,63.88 35.62,61.5 SV31.2
N$130  (via drill 0.61)
  Top 0.254: v29.38,57.75 29,58.12 21.25,58.12 18.75,55.62 18.75,54.5 8.7 | SV29.3 33.12,63.88 33.12,61.5 SV31.3
  Bottom 0.254: v29.38,57.75 33,61.38 SV31.3
N$131  (via drill 0.61)
  Top 0.254: 8.6 19.38,55.5 21.38,57.5 25.75,57.5 v26.12,57.12 | SV29.4 30.5,63.88 30.5,61.5 SV31.4
  Bottom 0.254: v26.12,57.12 30.38,61.38 SV31.4
N$132  (via drill 0.61)
  Top 0.254: v24.12,56.5 21.12,56.5 20,55.38 20,54.5 8.5 | SV29.5 28,63.88 28,61.5 SV31.5
  Bottom 0.254: v24.12,56.5 24.12,57.62 27.88,61.38 SV31.5
N$133  (via drill 0.61)
  Top 0.254: v23.62,55.25 23.25,55.62 21,55.62 20.75,55.38 20.75,54.5 8.4 | SV29.6 25.5,63.88 25.5,61.5 SV31.6
  Bottom 0.254: v23.62,55.25 23.62,55.62 23.12,56.12 23.12,59.12 25.38,61.38 SV31.6
N$134  (via drill 0.61)
  Top 0.254: v21.38,52.88 21.38,54.38 8.3 | SV29.7 22.88,63.88 22.88,61.5 SV31.7
  Bottom 0.254: v21.38,52.88 21.38,60 22.75,61.38 SV31.7
N$135  (via drill 0.61)
  Top 0.254: v22.75,52.88 22,53.62 22,54.38 8.2 | SV29.8 20.38,63.88 20.38,61.5 SV31.8
  Bottom 0.254: v22.75,52.88 21.75,51.88 21,51.88 20.38,52.5 20.38,61.38 SV31.8
N$136  (via drill 0.61)
  Top 0.254: v22,48.88 22,47.25 8.23 | SV30.1 17.88,63.88 17.88,61.5 SV32.1
  Bottom 0.254: v22,48.88 22,49.38 17.88,53.5 17.88,61.38 SV32.1
N$137  (via drill 0.61)
  Top 0.254: v20.5,48.88 21.38,48 21.38,47.25 8.22 | SV30.2 15.25,63.88 15.25,61.5 SV32.2
  Bottom 0.254: v20.5,48.88 20.12,49.25 20,49.25 15.25,54 SV32.2
N$138  (via drill 0.61)
  Top 0.254: v22.12,44.88 20.75,46.25 20.75,47.12 8.21 | v12.75,48.38 12.75,61.38 SV32.3 12.75,61.5 12.75,63.88 SV30.3
  Bottom 0.254: v22.12,44.88 20.5,43.25 17.88,43.25 v12.75,48.38
N$139  (via drill 0.61)
  Top 0.254: v20.75,44.88 20,45.62 20,47.12 8.20 | SV32.4 10.25,61.5 10.25,63.88 SV30.4
  Bottom 0.254: v20.75,44.88 19.75,43.88 18.62,43.88 3.88,58.62 3.88,65.12 4.62,65.88 8.25,65.88 10.12,64 SV30.4
N$140  (via drill 0.61)
  Top 0.254: 74.81,75.94 73.5,77.25 3.1 | 74.81,75.94 75.38,75.38 77.38,75.38 R9.1 | v74.38,89.25 82.12,97 155.5,97 169.38,83.12 169.38,52.25 158.25,41.12 136.12,41.12 129.88,47.38 129.88,48.38 U$5.7 | v71.25,89.25 71.25,88.62 74.88,85 74.88,76 74.81,75.94
  Bottom 0.254: v71.25,89.25 v74.38,89.25
N$141  (via drill 0.61)
  Top 0.254: v76.38,51.25 78.62,49 78.62,47.88 R12.2 78.62,47.75 75.75,44.88 75.75,41.12 77.5,39.38 v81.88,39.38 | v73,54.62 73,54.88 72.25,55.62 7.1 | v115.88,39.38 122.88,46.38 126,46.38 127.25,47.62 127.25,48.38 U$5.3
  Bottom 0.254: v73,54.62 v76.38,51.25 | v81.88,39.38 v115.88,39.38
N$142  (via drill 0.61)
  Top 0.254: v44.12,83.5 45.62,83.5 R14.1 | v32.25,81.5 33.25,81.5 4.1 | v129.25,49.88 129.25,48.5 U$5.6 | v82.5,42.75 v107.88,42.75 | v51,48.5 48.5,48.5 v44.38,52.62
  Bottom 0.254: v44.12,83.5 41.88,85.75 36.5,85.75 v32.25,81.5 32.62,81.75 36.75,77.62 36.75,72.62 44.38,65 v44.38,52.62 | v129.25,49.88 115,49.88 v107.88,42.75 | v82.5,42.75 80,45.25 71.5,45.25 70.88,44.62 54.88,44.62 v51,48.5
N$143  (via drill 0.61)
  Top 0.254: v29.12,49.12 30.38,49.12 R6.2 | v29.12,51.88 25.12,51.88 22.62,54.38 8.1 | v84.88,43.75 119.5,43.75 125.25,49.5 126.38,49.5 126.62,49.25 126.62,48.5 U$5.2
  Bottom 0.254: v29.12,51.88 29.12,50.75 | 29.12,50.75 v29.12,49.12 | v84.88,43.75 80.5,39.38 75.88,39.38 73,42.25 43.88,42.25 43.25,42.88 43.25,49.5 42,50.75 29.12,50.75
N$145  (via drill 0.61)
  Top 0.254: v157.38,56.62 C4.2 | MAIN.7 157.5,46.88 159.38,45 160.5,45 162.75,47.25 162.75,76.75 159.62,79.88 159.62,83.75 C1.2 159.5,83.88 v159.5,86.5 | 123.25,55.5 125.75,55.5 125.88,55.62 U$5.24 | 123.25,55.5 122,55.5 C5.1 | 2.24 112.88,68.75 114.75,70.62 114.75,74 116.5,75.75 118,75.75 C2.2 118.12,75.75 120.56,73.31 | v133.25,68 133.62,68.38 145.25,68.38 146,67.62 146,60.5 147.5,59 147.5,58.38 5.24 | v130.25,68 126.5,71.75 123.25,71.75 | 123.25,71.75 122.12,71.75 120.56,73.31 | 148.12,88.75 146.75,88.75 146.5,89 124.62,89 120.62,85 120.62,73.38 120.56,73.31 | 148.12,88.75 148.75,88.75 1.24 | 123.25,71.75 123.25,55.5 | 148.12,88.75 v148.12,92.5 | 6.24 104.38,56.88 101.25,53.75 101.25,52.12 C3.2 101.12,52 101.12,51.5 v100.38,50.75 | v77.38,70.12 77.38,71.5 C7.2 | v74.38,70.25 73.62,70.25 73.5,70.12 3.24 | 7.24 72.25,48.5 76.62,52.88 78.62,52.88 C6.2 78.75,53 v80,54.25 | v29,54.12 30.38,54.12 C8.2 30.5,54.12 37.88,54.12 44.5,47.5 v53.38,47.5 | v23.38,48.5 23.38,48 22.62,47.25 8.24 | 18.94,77.44 18.25,76.75 17.38,76.75 16.62,77.5 16.62,82.62 22.62,88.62 33.25,88.62 4.24 | 18.94,77.44 24.88,83.38 26.62,83.38 C9.2 | v19,72 19,77.38 18.94,77.44 | v120.62,52.75 120.62,52.12 119.62,51.12 v119.62,48.88 | v123.25,55.38 123.25,55.5
  Bottom 0.254: v157.38,56.62 157.38,47 MAIN.7 | v130.25,68 v133.25,68 | v159.5,86.5 159.5,93 156.12,96.38 152,96.38 v148.12,92.5 | v74.38,70.25 74.5,70.12 v77.38,70.12 77.38,68.12 80,65.5 v80,54.25 80.12,54.25 81.25,53.12 | v100.38,50.75 99.62,50.75 98.38,52 91.12,52 90,53.12 81.25,53.12 | v29,54.12 v23.38,48.5 23.5,48.75 21,51.25 20.88,51.25 19,53.12 v19,72 | 78.31,50.31 76.25,48.25 73,48.25 70.62,45.88 56.38,45.88 54.75,47.5 v53.38,47.5 | 78.31,50.31 81.12,53.12 81.25,53.12 | v120.62,52.75 v123.25,55.38 | v119.62,48.88 115.38,48.88 107.12,40.62 99,40.62 90.88,48.75 90.88,49.38 90,50.25 78.38,50.25 78.31,50.31
N$148  (via drill 0.61)
  Top 0.254: v19.38,44.88 8.19 | SV33.1 7.62,63.88 7.62,61 SV34.1
  Bottom 0.254: v19.38,44.88 19.38,46.62 7.62,58.38 7.62,60.88 SV34.1
N$149  (via drill 0.61)
  Top 0.254: v18.25,45.62 18.75,46.12 18.75,47.12 8.18 | SV33.2 5.12,63.88 5.12,61 SV34.2
  Bottom 0.254: v18.25,45.62 18.25,47 5.12,60.12 5.12,60.88 SV34.2
N$150  (via drill 0.61)
  Top 0.254: v18.75,48.62 18.12,48 18.12,47.25 8.17 | v54.62,46.25 40.75,46.25 SV36.1
  Bottom 0.254: v18.75,48.62 19.38,48.62 20.5,47.5 36.75,47.5 39.38,50.12 41.88,50.12 42.62,49.38 42.62,48.25 40.75,46.38 SV36.1 | v54.62,46.25 55.62,45.25 70.75,45.25 71.75,46.25 88.88,46.25 SV35.1
N$151  (via drill 0.61)
  Top 0.254: v30.75,44.12 30.5,43.88 18.62,43.88 17.25,45.25 17.25,46 17.38,46.12 17.38,47.12 8.16 | v70.5,41.25 v76.5,47.25
  Bottom 0.254: v30.75,44.12 35.88,44.12 38.06,46.31 | 38.06,46.31 40.62,48.88 SV36.2 | v76.5,47.25 78.12,48.88 88.88,48.88 SV35.2 | v70.5,41.25 43.12,41.25 38.06,46.31

### Text on the board
tPlace: AUX | MAIN